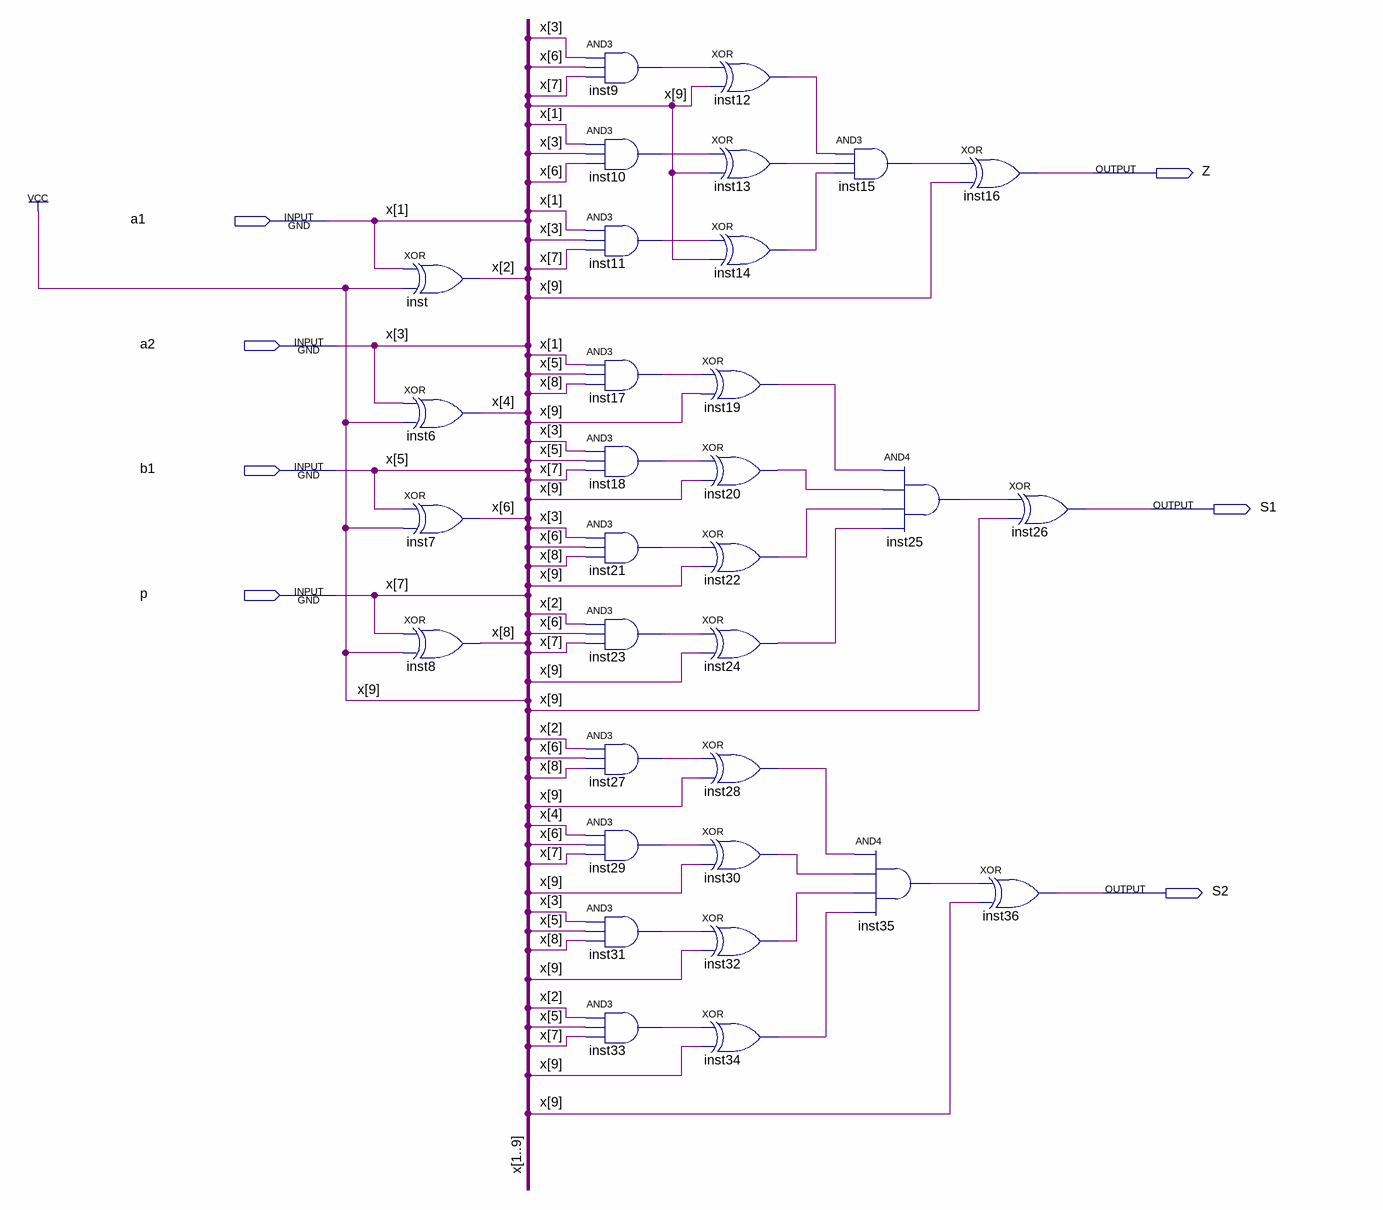
[diagram p0: schematic sheet]
// Quartus schematic OCHS.bdf as structural Verilog: 32 symbols, 7 pins
module OCHS (
  input  a1,
  input  a2,
  input  b1,
  input  p,
  output Z,
  output S1,
  output S2
);

  wire inst9_out, inst10_out, inst11_out, inst12_out, inst13_out, inst14_out, inst15_out, inst17_out,
       inst18_out, inst19_out, inst20_out, inst21_out, inst22_out, inst23_out, inst24_out, inst25_out,
       inst27_out, inst28_out, inst29_out, inst30_out, inst31_out, inst32_out, inst33_out, inst34_out,
       inst35_out;
  wire [8:2] x;

  xor inst (x[2], a1, 1'b1);
  xor inst6 (x[4], a2, 1'b1);
  xor inst7 (x[6], b1, 1'b1);
  xor inst8 (x[8], p, 1'b1);
  and inst9 (inst9_out, a2, x[6], p);
  and inst10 (inst10_out, a1, a2, x[6]);
  and inst11 (inst11_out, a1, a2, p);
  and inst17 (inst17_out, a1, b1, x[8]);
  and inst18 (inst18_out, a2, b1, p);
  and inst21 (inst21_out, a2, x[6], x[8]);
  and inst23 (inst23_out, x[2], x[6], p);
  and inst27 (inst27_out, x[2], x[6], x[8]);
  and inst29 (inst29_out, x[4], x[6], p);
  and inst31 (inst31_out, a2, b1, x[8]);
  and inst33 (inst33_out, x[2], b1, p);
  xor inst12 (inst12_out, inst9_out, 1'b1);
  xor inst13 (inst13_out, inst10_out, 1'b1);
  xor inst14 (inst14_out, inst11_out, 1'b1);
  xor inst19 (inst19_out, inst17_out, 1'b1);
  xor inst20 (inst20_out, inst18_out, 1'b1);
  xor inst22 (inst22_out, inst21_out, 1'b1);
  xor inst24 (inst24_out, inst23_out, 1'b1);
  xor inst28 (inst28_out, inst27_out, 1'b1);
  xor inst30 (inst30_out, inst29_out, 1'b1);
  xor inst32 (inst32_out, inst31_out, 1'b1);
  xor inst34 (inst34_out, inst33_out, 1'b1);
  and inst15 (inst15_out, inst12_out, inst13_out, inst14_out);
  and inst25 (inst25_out, inst19_out, inst20_out, inst22_out, inst24_out);
  and inst35 (inst35_out, inst28_out, inst30_out, inst32_out, inst34_out);
  xor inst16 (Z, inst15_out, 1'b1);
  xor inst36 (S2, inst35_out, 1'b1);
  xor inst26 (S1, inst25_out, 1'b1);

  // Other names for the same wires on the sheet: x (some bits) = {p, b1, a2, a1}
endmodule
